# EAGLE design AnalogDaisy (EAGLE 8.5.2)
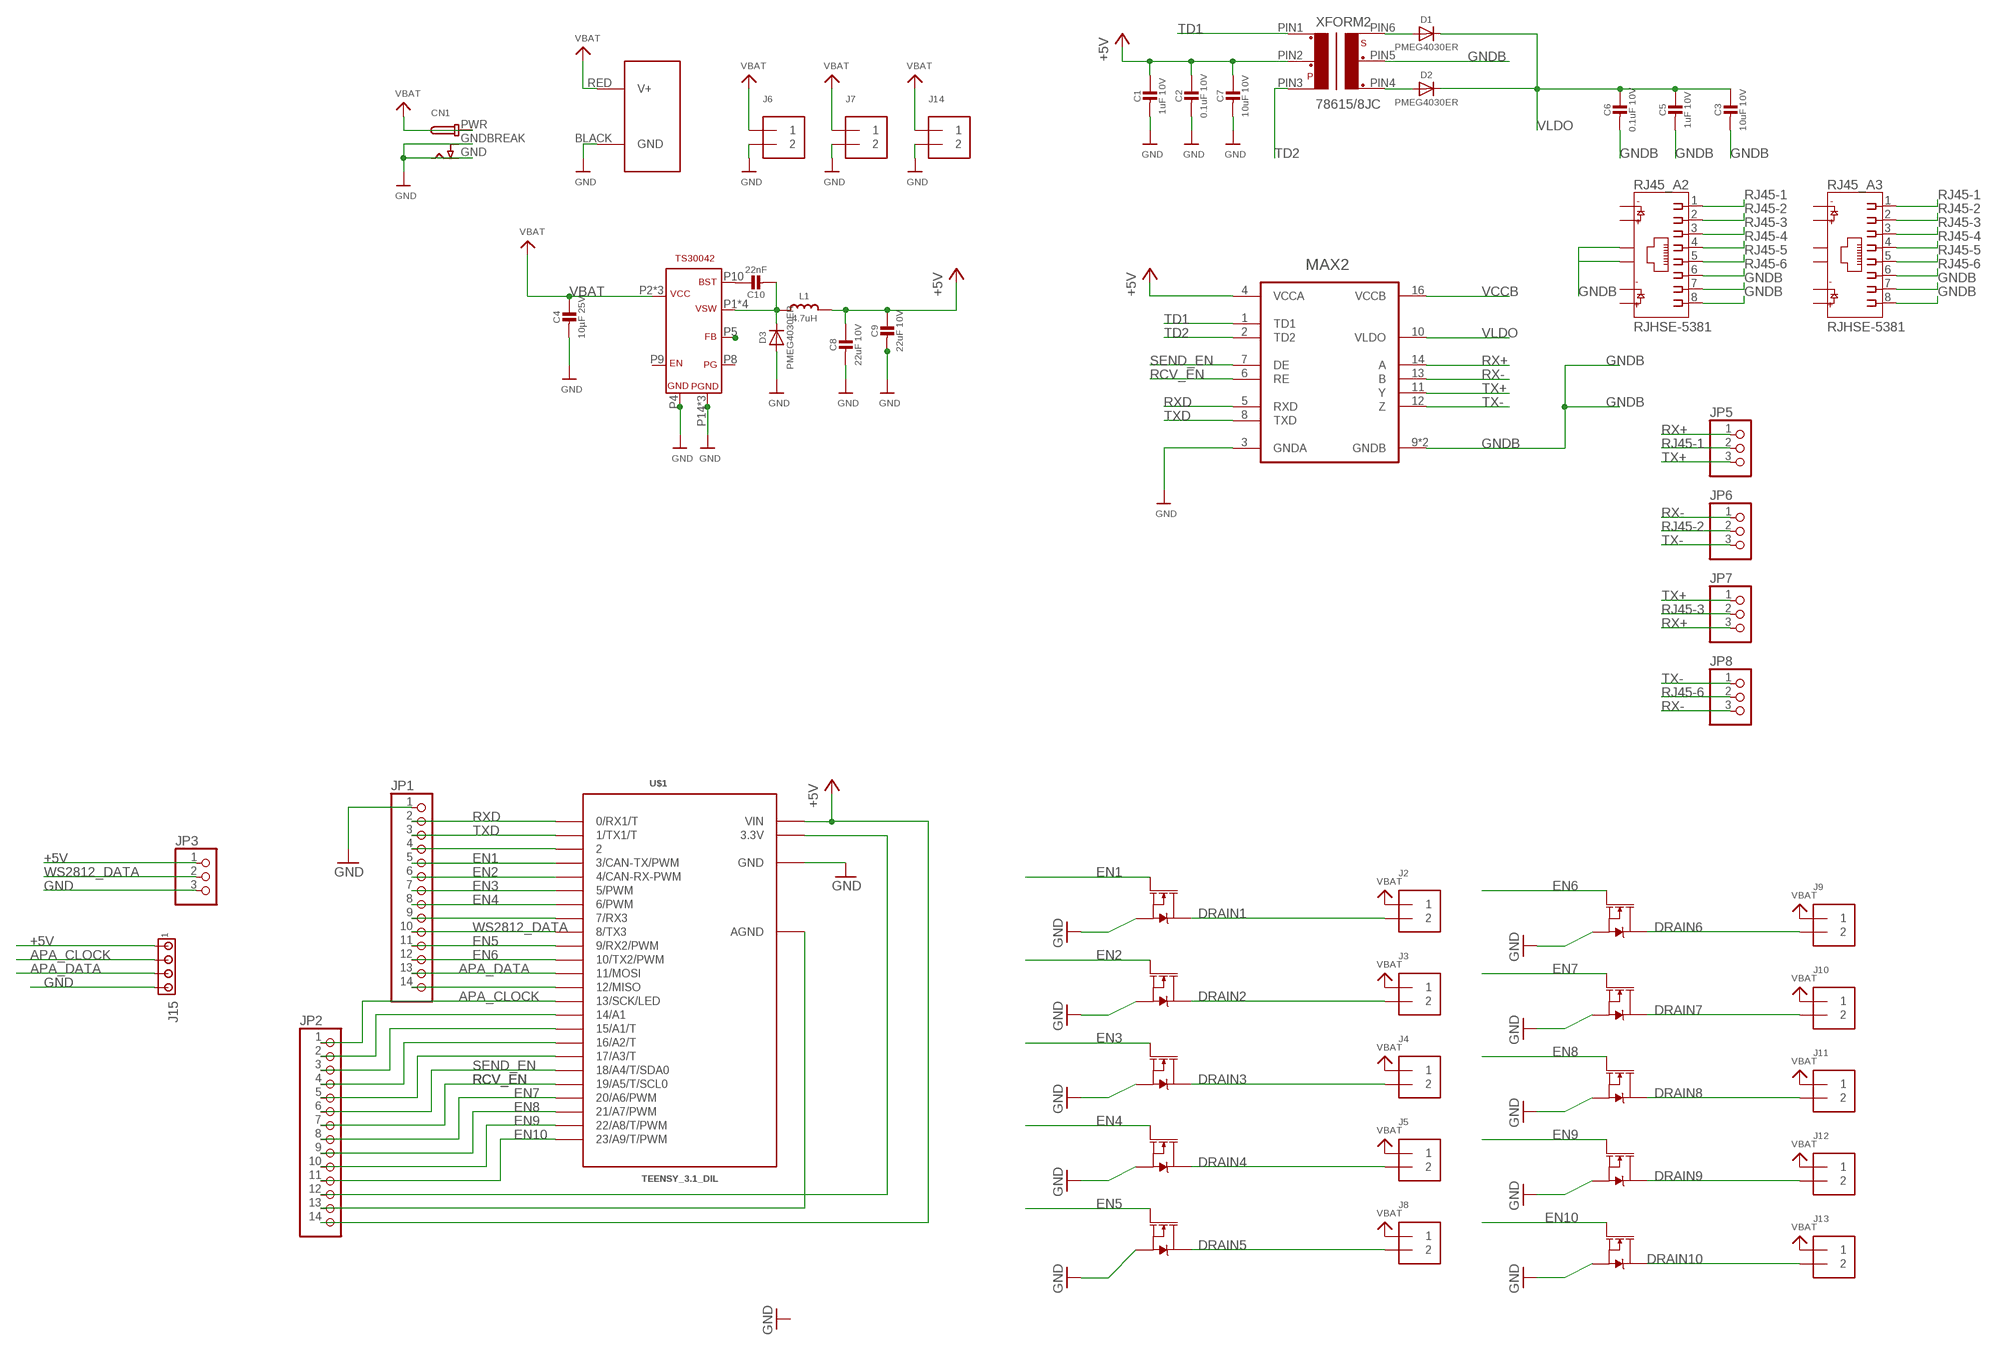
[diagram p0: schematic, sheet 1]

## Parts
C1  1uF 10V  CAP_CERAMIC0603MINI  [0603-MINI]
C2  0.1uF 10V  CAP_CERAMIC0603MINI  [0603-MINI]
C3  10uF 10V  CAP_CERAMIC0603MINI  [0603-MINI]
C4  10µF 25V  CAP_CERAMIC0603MINI  [0603-MINI]
C5  1uF 10V  CAP_CERAMIC0603MINI  [0603-MINI]
C6  0.1uF 10V  CAP_CERAMIC0603MINI  [0603-MINI]
C7  10uF 10V  CAP_CERAMIC0603MINI  [0603-MINI]
C8  22uF 10V  CAP_CERAMIC0603MINI  [0603-MINI]
C9  22uF 10V  CAP_CERAMIC0603MINI  [0603-MINI]
C10  22nF  CAP_CERAMIC0603MINI  [0603-MINI]
CN1  DCBARRELPTH  [DCJACK_2MM_PTH]
D1  PMEG4030ER  DIODESOD-123  [SOD-123]
D2  PMEG4030ER  DIODESOD-123  [SOD-123]
D3  PMEG4030ER  DIODESOD-123  [SOD-123]
J1  POWERPOLE_POWER45A_DRILL  [POWERPOLE_PAIR_45A_HOLE]
J2  TERMBLOCK_1X2  [TERMBLOCK_1X2-3.5MM]
J3  TERMBLOCK_1X2  [TERMBLOCK_1X2-3.5MM]
J4  TERMBLOCK_1X2  [TERMBLOCK_1X2-3.5MM]
J5  TERMBLOCK_1X2  [TERMBLOCK_1X2-3.5MM]
J6  TERMBLOCK_1X2  [TERMBLOCK_1X2-3.5MM]
J7  TERMBLOCK_1X2  [TERMBLOCK_1X2-3.5MM]
J8  TERMBLOCK_1X2  [TERMBLOCK_1X2-3.5MM]
J9  TERMBLOCK_1X2  [TERMBLOCK_1X2-3.5MM]
J10  TERMBLOCK_1X2  [TERMBLOCK_1X2-3.5MM]
J11  TERMBLOCK_1X2  [TERMBLOCK_1X2-3.5MM]
J12  TERMBLOCK_1X2  [TERMBLOCK_1X2-3.5MM]
J13  TERMBLOCK_1X2  [TERMBLOCK_1X2-3.5MM]
J14  TERMBLOCK_1X2  [TERMBLOCK_1X2-3.5MM]
J15  4PIN-JST/TE  [BOARDMOUNT-LED]
JP1  PINHD-1X14  [1X14]
JP2  PINHD-1X14  [1X14]
JP3  PINHD-1X3  [1X03]
JP5  PINHD-1X3  [1X03]
JP6  PINHD-1X3  [1X03]
JP7  PINHD-1X3  [1X03]
JP8  PINHD-1X3  [1X03]
L1  4.7uH  INDUCTORTDK_VLC5045  [INDUCTOR_5X5MM_TDK_VLC5045]
MAX2  MAX14853GWE+  [SOIC127P1034X267-16N]
Q1  35A/25V/8.5mΩ  MOSFET-NCH-FDD8780  [DPAK]
Q2  35A/25V/8.5mΩ  MOSFET-NCH-FDD8780  [DPAK]
Q3  35A/25V/8.5mΩ  MOSFET-NCH-FDD8780  [DPAK]
Q4  35A/25V/8.5mΩ  MOSFET-NCH-FDD8780  [DPAK]
Q5  35A/25V/8.5mΩ  MOSFET-NCH-FDD8780  [DPAK]
Q6  35A/25V/8.5mΩ  MOSFET-NCH-FDD8780  [DPAK]
Q7  35A/25V/8.5mΩ  MOSFET-NCH-FDD8780  [DPAK]
Q8  35A/25V/8.5mΩ  MOSFET-NCH-FDD8780  [DPAK]
Q9  35A/25V/8.5mΩ  MOSFET-NCH-FDD8780  [DPAK]
Q10  35A/25V/8.5mΩ  MOSFET-NCH-FDD8780  [DPAK]
RJ45_A2  RJHSE-5381  [AMPHENOL_RJHSE-5381]
RJ45_A3  RJHSE-5381  [AMPHENOL_RJHSE-5381]
U$1  TEENSY_3.1_DIL  [TEENSY3-DIL]
U$2  BUCK_CONVERTER  [QFN-16]
XFORM2  78615/8JC  [0.1_SMD]

## Nets
+3V1: U$2.P5(FB)
+5V: C1.1 C2.1 C7.1 C8.1 C9.1 J15.1 JP2.14 JP3.1 L1.P$2 MAX2.4(VCCA) U$1.VIN XFORM2.PIN2
APA_CLOCK: J15.2 JP2.1 U$1.13(13/SCK/LED)
APA_DATA: J15.3 JP1.13 U$1.11(11/MOSI)
DRAIN1: J2.2 Q1.4(D)
DRAIN2: J3.2 Q3.4(D)
DRAIN3: J4.2 Q5.4(D)
DRAIN4: J5.2 Q6.4(D)
DRAIN5: J8.2 Q2.4(D)
DRAIN6: J9.2 Q4.4(D)
DRAIN7: J10.2 Q7.4(D)
DRAIN8: J11.2 Q8.4(D)
DRAIN9: J12.2 Q9.4(D)
DRAIN10: J13.2 Q10.4(D)
EN1: JP1.5 Q1.1(G) U$1.3(3/CAN-TX/PWM)
EN2: JP1.6 Q3.1(G) U$1.4(4/CAN-RX-PWM)
EN3: JP1.7 Q5.1(G) U$1.5(5/PWM)
EN4: JP1.8 Q6.1(G) U$1.6(6/PWM)
EN5: JP1.11 Q2.1(G) U$1.9(9/RX2/PWM)
EN6: JP1.12 Q4.1(G) U$1.10(10/TX2/PWM)
EN7: JP2.8 Q7.1(G) U$1.20/A6(20/A6/PWM)
EN8: JP2.9 Q8.1(G) U$1.21/A7(21/A7/PWM)
EN9: JP2.10 Q9.1(G) U$1.22/A8(22/A8/T/PWM)
EN10: JP2.11 Q10.1(G) U$1.23/A9(23/A9/T/PWM)
GND: C1.2 C2.2 C4.2 C7.2 C8.2 C9.2 CN1.GND CN1.GNDBREAK D3.A J1.BLACK(GND) J6.2 J7.2 J14.2 J15.4 JP1.1 JP3.3 MAX2.3(GNDA) Q1.3(S) Q2.3(S) Q3.3(S) Q4.3(S) Q5.3(S) Q6.3(S) Q7.3(S) Q8.3(S) Q9.3(S) Q10.3(S) U$1.GND U$2.P4(GND) U$2.P14(PGND) U$2.P15(PGND) U$2.PAD(PGND)
GNDB: C3.2 C5.2 C6.2 MAX2.9(GNDB) MAX2.15(GNDB) RJ45_A2.7 RJ45_A2.8 RJ45_A2.S1 RJ45_A2.S2 RJ45_A3.7 RJ45_A3.8 XFORM2.PIN5
N$1: C10.1 U$2.P10(BST)
N$2: D1.A XFORM2.PIN6
N$3: JP2.12 U$1.3.3V
N$4: C10.2 D3.C L1.P$1 U$2.P1(VSW) U$2.P12(VSW) U$2.P13(VSW) U$2.P16(VSW)
N$5: D2.A XFORM2.PIN4
N$6: JP1.4 U$1.2
N$7: JP1.9 U$1.7(7/RX3)
N$10: JP1.14 U$1.12(12/MISO)
N$12: JP2.2 U$1.14/A0(14/A1)
N$13: JP2.3 U$1.15/A1(15/A1/T)
N$14: JP2.4 U$1.16/A2(16/A2/T)
N$15: JP2.5 U$1.17/A3(17/A3/T)
N$18: JP2.13 U$1.AGND
RCV_EN: JP2.7 MAX2.6(RE) U$1.19/A5(19/A5/T/SCL0)
RJ45-1: JP5.2 RJ45_A2.1 RJ45_A3.1
RJ45-2: JP6.2 RJ45_A2.2 RJ45_A3.2
RJ45-3: JP7.2 RJ45_A2.3 RJ45_A3.3
RJ45-4: RJ45_A2.4 RJ45_A3.4
RJ45-5: RJ45_A2.5 RJ45_A3.5
RJ45-6: JP8.2 RJ45_A2.6 RJ45_A3.6
RX+: JP5.1 JP7.3 MAX2.14(A)
RX-: JP6.1 JP8.3 MAX2.13(B)
RXD: JP1.2 MAX2.5(RXD) U$1.0(0/RX1/T)
SEND_EN: JP2.6 MAX2.7(DE) U$1.18/A4(18/A4/T/SDA0)
TD1: MAX2.1(TD1) XFORM2.PIN1
TD2: MAX2.2(TD2) XFORM2.PIN3
TX+: JP5.3 JP7.1 MAX2.11(Y)
TX-: JP6.3 JP8.1 MAX2.12(Z)
TXD: JP1.3 MAX2.8(TXD) U$1.1(1/TX1/T)
VBAT: C4.1 CN1.PWR J1.RED(V+) J2.1 J3.1 J4.1 J5.1 J8.1 J9.1 J10.1 J11.1 J12.1 J13.1 U$2.P2(VCC) U$2.P3(VCC) U$2.P11(VCC)
VCCB: MAX2.16(VCCB)
VLDO: C3.1 C5.1 C6.1 D1.C D2.C MAX2.10(VLDO)
WS2812_DATA: JP1.10 JP3.2 U$1.8(8/TX3)
Unconnected: J6.1 J7.1 J14.1 RJ45_A2.9 RJ45_A2.10 RJ45_A2.11 RJ45_A2.12 RJ45_A3.9 RJ45_A3.10 RJ45_A3.11 RJ45_A3.12 RJ45_A3.S1 RJ45_A3.S2 U$2.P8(PG) U$2.P9(EN)

## Library data of the parts
C1-C10 = microbuilder:CAP_CERAMIC: Ceramic Capacitors For new designs, use the packages preceded by an '_' character since they are more reliable: The following footprints should be used on most boards: _0402 - Standard footprint for regular board layouts _0603 - Standard footprint for regular board layouts _0805 - Standard footprint for regular board layouts _1206 - Standard footprint for regular board layouts For extremely tight-pitch boards where space is at a premium, the following 'micro-pitch' footprints can be used (smaller pads, no silkscreen outline, etc.): _0402MP - Micro-pitch footprint for very dense/compact boards _0603MP - Micro-pitch footprint for very dense/compact boards _0805MP - Micro-pitch footprint for very dense/compact boards _1206MP - Micro-pitch footprint for very dense/compact boards
CN1 = microbuilder:DCBARREL: DC Barrel Jack DCJACK_1.3MM_PTH - Through Hole 1.3mm Jack (4UConnector: 05536) DCJACK_2MM_PTH - Through Hole 2.0/2.1 Jack (4UConnector: 05537) DCJACK_2MM_SMT - SMT 2.0/2.1mm Jack(4UConnector: 03267)
D1-D3 = microbuilder:DIODE: Diode SMA Model Volts Amps Type Vf Ir Digikey # Notes SSA34-E3 40V 3A Schottky 480mV @ 3A 200uA @ 40V SSA34-E3/61TGITR-ND CDBA120-G 20V 1A Schottky 500mV @ 1A 500uA @ 20V 641-1014-6-ND REEL MBRA210 10V 2A Schottky 350mV @ 2A 700uA @ 10V MBRA210LT3 SOD-123 Model Volts Amps Type Vf Ir Order # Notes BAT54T1G 30V 200mA Schottky 800mV @ 200mA 2uA @ 25V BAT54T1GOSTR-ND B0530W 30V 500mA Schottky 430mV @ 500mA 130uA @ 30V B0530W-FDICT-ND REEL MBR120 20V 1A Schottky 340mV @ 1A MBR120VLSFT1GOSCT-ND SOD-323 Model Volts Amps Type Vf Ir Order # Notes PMEG2005EJ 20V 500mA Schottky 355mV @ 500mA 568-4110-1-ND ZLLS410 10V 570mA Schottky 380mV @ 570mA ZLLS410CT-ND 1N4148WS 75V 150mA Silicon/Simple 1V 1N4148WSFSCT-ND REEL SOD-523 Model Volts Amps Type Vf Ir Order # Notes BAT54XV2 30V 200mA Schottky 0.8V @ 100mA BAT54XV2CT-ND TB751S 30V 30mA Schottky RB751S-40TE61CT-ND SOT23-R/W (R = Solder Paste/Reflow Ovens, W = Hand-Soldering) Model Volts Amps Type Vf Ir Order # Notes BAT54FILM 40V 300mA Schottky 497-7162-1-ND POWERDI-5 Model Volts Amps Type Vf Ir Order # Notes PDS560 60V 5A Schottky 670mV @ 5A 150uA @ 60V PDS560DICT-ND
J1 = powerpoles:POWERPOLE_POWER: Anderson Powerpole Power Connector using ameteur radio standard layout
J2-J14 = microbuilder:TERMBLOCK_1X2: 3.5mm Terminal block http://www.ladyada.net/library/pcb/eaglelibrary.html
J15 = My Connectors:4PIN-JST/TE: AMP connector
JP1 JP2 = adafruit:PINHD-1X14: PIN HEADER
JP3 JP5-JP8 = adafruit:PINHD-1X3: PIN HEADER
L1 = microbuilder:INDUCTOR: Inductors 0603: 10nH Ceramic Inductor - microwire antenna/RF (Digikey: 712-1434-2-ND) 0805: 560nH Ceramic Inductor - RF (Digikey: 553-1047-1-ND) 270nH Ceramic Inductor - Q = 40@250MHz, +-5%, 1 Ohm DC Resistance (Digikey: 535-10506-2-ND) 1007 (2518 Metric) SMT: 10µH 10% 250mOhm 820mA 1007 Inductor (Digikey: 587-2189-1-ND) 22µH 10% 500mOhm 580mA 1007 Inductor (Digikey: 587-2190-1-ND) 47µH 10% 950mOhm 420mA 1007 Inductor (Digikey: 587-2191-1-ND) 47µH 5% 100mOhm 1A 1008 Inductor (Digikey: 732-1816-1-ND) 5.0x5.0mm (Taiyo Yuden NR5040 Series) 6.8µH 20% 2.3A 64mOhm Inductor (Digikey: 587-2374-2-ND) 5.0x5.0mm (TDK VLC5045 Series) 4.7µH 20% 3.3A 34mOhm Inductor (Digikey: 445-6526-1-ND) 6.8µH 20% 2.7A 46mOhm Inductor (Digikey: 445-6527-1-ND) 6.0x6.0mm (TDK VLC6045 Series) 4.7µH 20% 3.8A 27mOhm Inductor (Digikey: 445-6538-2-ND) 6.8µH 20% 3A 41mOhm Inductor (Digikey: 445-6540-1-ND) 6.2µH 30% 2.2A 45mOhm Inductor (Digikey: SRR5028-6R2YCT-ND) - Not TDK VLC6045 but footprint should match 6.0x6.0mm (TDK SLF6045 Series) 6.8uH 30% 2A 33mOhm Inductor (Digikey: 445-4572-1-ND, Mouser: 810-SLF645T6R8N2R0PF) 6.0x6.0mm (Sumida CDRH5D28 Series) 6.2uH 30% 1.8A 45mOhm Inductor (Digikey: 308-1542-1-ND) Taiyo Yuden NR3015T2R2M - 2.2uH 20% 1.5A (Digikey: 587-1648-2-ND, Mouser: 963-NR3015T2R2M) - Used with TI TPS62172 CoilCraft RFID Transponder Coil - MA5532-AE (For use with AS3935 Lightning Sensor) Taiyo Yuden NRH2412T2R2MNGH - 2.2uH 20% 1AA (Digikey: 587-3443-1-ND) - Used with TI LM3671 Vishay IHLP 1.0uH Molded Inductor - 24mOhm DCR, 5A, +/-20%, -55°C-125°C (Digikey: 541-1319-1-ND)
MAX2 = Maxim_By_element14_Batch_1:MAX14853GWE+: Isolated RS-485 Tranceiver
Q1-Q10 = SparkFun-DiscreteSemi:MOSFET-NCH: N-channel MOSFETs Voltage controlled devices that allow control of high current outputs. SparkFun Products: SparkFun OpenScale <https://www.sparkfun.com/products/13261> SparkFun Digital Sandbox <https://www.sparkfun.com/products/12651> SparkFun Monster Moto Shield <https://www.sparkfun.com/products/10182> SparkFun MOSFET Power Controller <https://www.sparkfun.com/products/11214>; PROD_ID: TRANS-09984
RJ45_A2 RJ45_A3 = RJHSE-5381:RJHSE-5381: connector, mod jack, rt angle pcb, shielded, led1-g, led2-y, single port, rj-45 8 cont; AVAILABILITY: Good; DESCRIPTION: CONN MOD JACK 8P8C R/A SHIELDED; MF: Amphenol; MP: RJHSE-5381; PACKAGE: None; PRICE: 1.11 USD
U$1 = Teensy_3_and_LC_Series_Boards_v1.0:TEENSY_3.1_DIL: Teensy 3.1 or 3.2 in a DIL Layout.
U$2 = Heep:BUCK_CONVERTER
XFORM2 = trafo-murata:78615/8JC

## Board
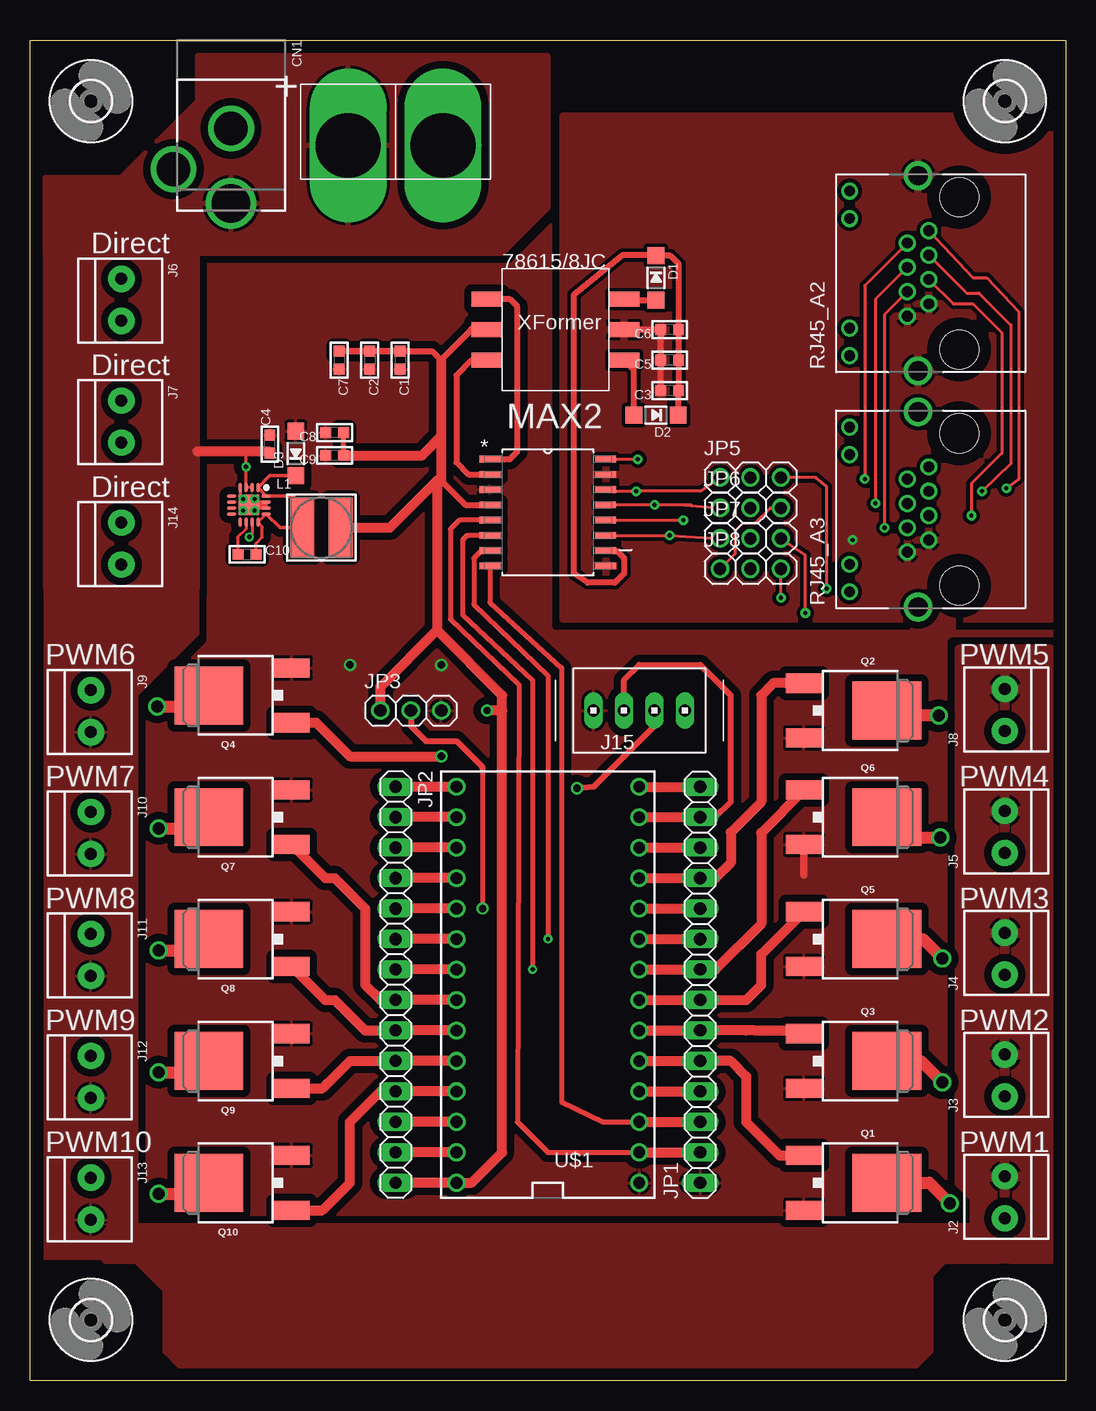
[diagram p1: board, top side]
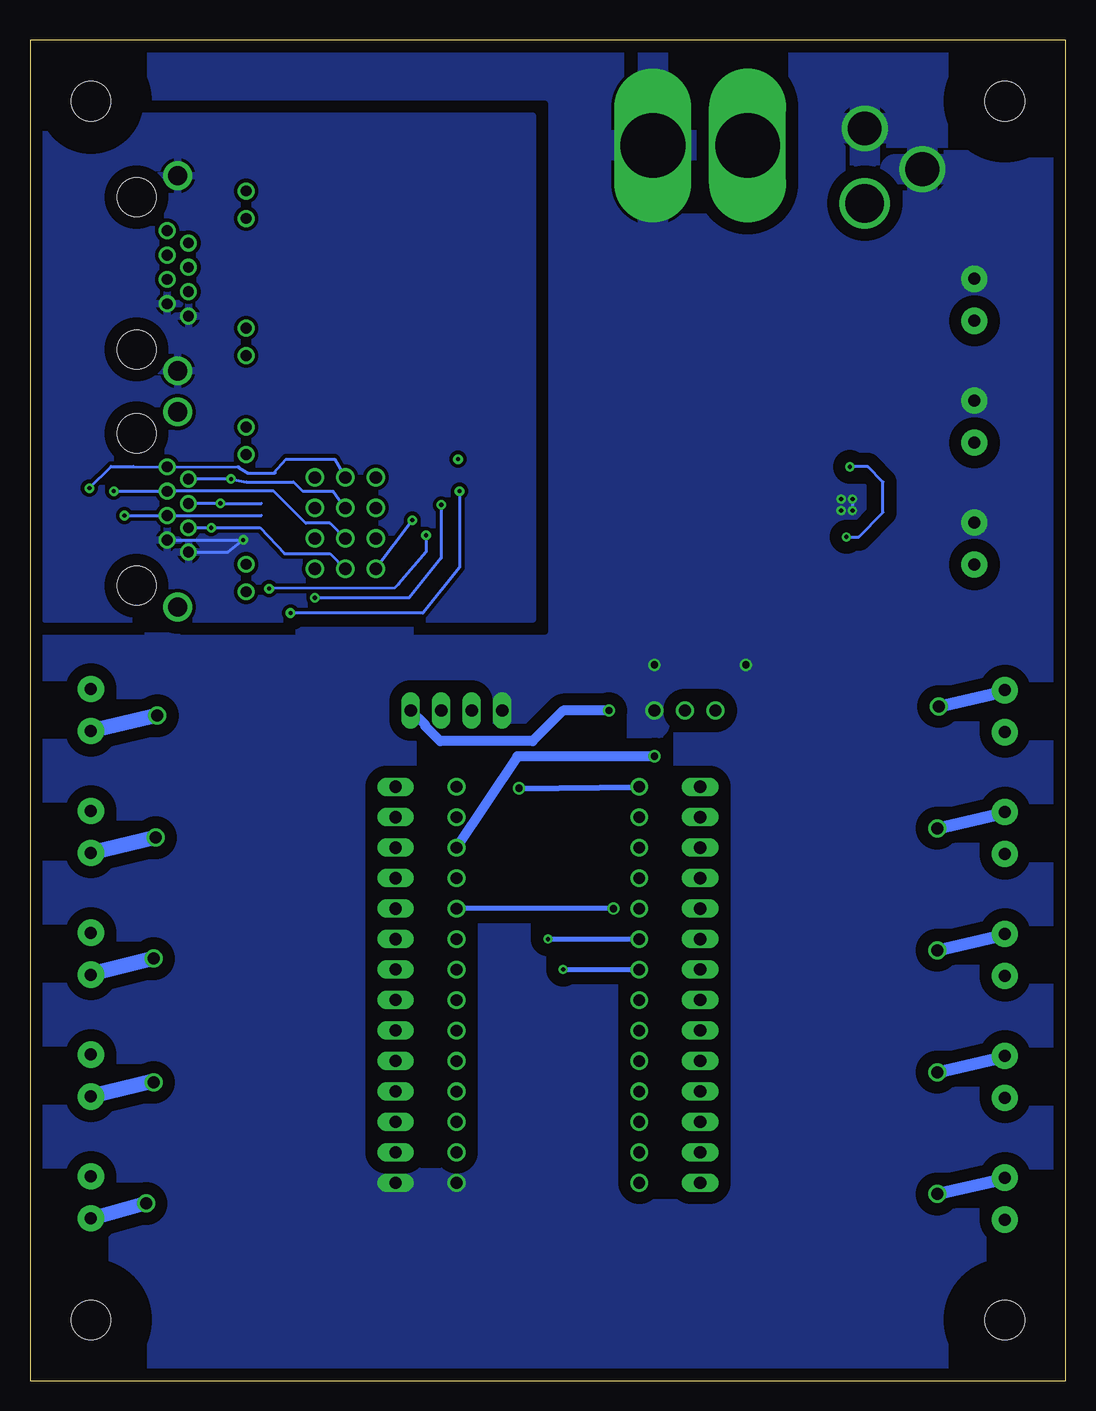
[diagram p2: board, bottom side, seen from below]

Size 86.36 x 111.76 mm. Coordinates in mm from the lower left corner, seen from the top.
Outline: 86.36,111.76 86.36,0 0,0 0,111.76 86.36,111.76
Copper layers (1*16): Top 0.035mm / dielectric 1.5mm / Bottom 0.035mm
Design rules "default": minimum track width 6mil, minimum drill 0.35mm, track to track 6mil, track to pad 6mil, pad to pad 6mil, via to via 6mil, smd to smd 6mil, copper to edge 40mil, drill to drill 6mil, minimum pad ring 10mil, minimum via ring 8mil, stop-mask expansion 4mil, vias tented up to drill 0mil, thermal gap 10mil

### Footprints (pad centres in the part's own frame; a part is rotated, then mirrored left to right if it is on the bottom)
0603-MINI = smd 0.9 x 0.9: 1 -0.75,0; 2 0.75,0
DCJACK_2MM_PTH = drill 2.8: GND 0,7.35; GNDBREAK 4.8,10.75 | drill 3.2: PWR 0,13.6
SOD-123 = smd 1.4 x 1.4: A 1.85,0; C -1.85,0
POWERPOLE_PAIR_45A_HOLE = drill 5.4 long: BLACK 3.95,-1.15; RED -3.95,-1.15
TERMBLOCK_1X2-3.5MM = drill 1 pad 2.184: 1 1.8,0; 2 -1.7,0
BOARDMOUNT-LED = drill 1.016 long: 1 3.81,0; 2 1.27,0; 3 -1.27,0; 4 -3.81,0
1X14 = drill 1.016 long: 1 -16.51,0; 2 -13.97,0; 3 -11.43,0; 4 -8.89,0; 5 -6.35,0; 6 -3.81,0; 7 -1.27,0; 8 1.27,0; 9 3.81,0; 10 6.35,0; 11 8.89,0; 12 11.43,0; 13 13.97,0; 14 16.51,0
1X03 = drill 1.016: 1 -2.54,0; 2 0,0; 3 2.54,0
INDUCTOR_5X5MM_TDK_VLC5045 = smd 2 x 5: P$1 -1.6,0; P$2 1.6,0
SOIC127P1034X267-16N = smd 1.727 x 0.559: 1 -4.826,4.445; 2 -4.826,3.175; 3 -4.826,1.905; 4 -4.826,0.635; 5 -4.826,-0.635; 6 -4.826,-1.905; 7 -4.826,-3.175; 8 -4.826,-4.445; 9 4.826,-4.445; 10 4.826,-3.175; 11 4.826,-1.905; 12 4.826,-0.635; 13 4.826,0.635; 14 4.826,1.905; 15 4.826,3.175; 16 4.826,4.445
DPAK = smd 1.6 x 3: 1 -2.28,-5.31; 3 2.28,-5.31 | smd 4.826 x 5.715: 4 0,1.588
AMPHENOL_RJHSE-5381 = drill 0.9: 1 3.55,2.54; 2 2.53,4.32; 3 1.52,2.54; 4 0.5,4.32; 5 -0.51,2.54; 6 -1.53,4.32; 7 -2.54,2.54; 8 -3.56,4.32; 9 6.86,9.14; 10 4.57,9.14; 11 -4.57,9.14; 12 -6.86,9.14 | drill 1.6: S1 8.13,3.43; S2 -8.13,3.43 | hole 3.25: 6.35,0; -6.35,0
TEENSY3-DIL = drill 0.965: 0 -7.62,13.97; 1 -7.62,11.43; 2 -7.62,8.89; 3 -7.62,6.35; 3.3V 7.62,11.43; 4 -7.62,3.81; 5 -7.62,1.27; 6 -7.62,-1.27; 7 -7.62,-3.81; 8 -7.62,-6.35; 9 -7.62,-8.89; 10 -7.62,-11.43; 11 -7.62,-13.97; 12 -7.62,-16.51; 13 7.62,-16.51; 14/A0 7.62,-13.97; 15/A1 7.62,-11.43; 16/A2 7.62,-8.89; 17/A3 7.62,-6.35; 18/A4 7.62,-3.81; 19/A5 7.62,-1.27; 20/A6 7.62,1.27; 21/A7 7.62,3.81; 22/A8 7.62,6.35; 23/A9 7.62,8.89; AGND 7.62,13.97; GND -7.62,16.51; VIN 7.62,16.51
QFN-16 = smd 0.8 x 0.3: P1 -1.45,0.75; P2 -1.45,0.25; P3 -1.45,-0.25; P4 -1.45,-0.75; P9 1.45,-0.75; P10 1.45,-0.25; P11 1.45,0.25; P12 1.45,0.75 | smd 0.3 x 0.8: P5 -0.75,-1.45; P6 -0.25,-1.45; P7 0.25,-1.45; P8 0.75,-1.45; P13 0.75,1.45; P14 0.25,1.45; P15 -0.25,1.45; P16 -0.75,1.45 | smd 1.7 x 1.7: PAD 0,0
3,3 = hole 3.3: 0,0
0.1_SMD = smd 2.54 x 1.27: PIN1 -11.43,1.27; PIN2 -11.43,-1.27; PIN3 -11.43,-3.81; PIN4 0,-3.81; PIN5 0,-1.27; PIN6 0,1.27

### Placement (x,y rotation side)
C1  30.86,85.09 270 top
C2  28.32,85.09 270 top
C3  53.34,82.55 180 top
C4  20,78.1 90 top
C5  53.34,85.09 180 top
C6  53.34,87.63 180 top
C7  25.78,85.09 270 top
C8  25.4,79.06 180 top
C9  25.4,77.15 180 top
C10  18.1,68.9 0 top
CN1  16.76,111.76 180 top
D1  52.2,91.95 270 top
D2  52.2,80.52 180 top
D3  22.16,77.32 90 top
J1  30.48,104.14 0 top
J2  81.28,15.24 90 top
J3  81.28,25.4 90 top
J4  81.28,35.56 90 top
J5  81.28,45.72 90 top
J6  7.62,90.17 270 top
J7  7.62,80.01 270 top
J8  81.28,55.88 90 top
J9  5.08,55.88 270 top
J10  5.08,45.72 270 top
J11  5.08,35.56 270 top
J12  5.08,25.4 270 top
J13  5.08,15.24 270 top
J14  7.62,69.85 270 top
J15  50.8,55.88 0 top
JP1  55.88,33.02 90 top
JP2  30.48,33.02 270 top
JP3  31.75,55.88 0 top
JP5  60.07,75.31 0 top
JP6  60.07,72.77 0 top
JP7  60.07,70.23 0 top
JP8  60.07,67.69 0 top
L1  24.29,71.12 0 top
MAX2  43.18,72.39 0 top
Q1  69.85,16.51 270 top
Q2  69.85,55.88 270 top
Q3  69.85,26.67 270 top
Q4  16.51,57.15 90 top
Q5  69.85,36.83 270 top
Q6  69.85,46.99 270 top
Q7  16.51,46.99 90 top
Q8  16.51,36.83 90 top
Q9  16.51,26.67 90 top
Q10  16.51,16.51 90 top
RJ45_A2  77.47,92.33 90 top
RJ45_A3  77.47,72.64 90 top
U$1  43.18,33.02 180 top
U$2  18.26,73.03 270 top
U$11  [3,3]  5.08,106.68 0 top
U$15  [3,3]  81.28,106.68 0 top
U$16  [3,3]  5.08,5.08 0 top
U$19  [3,3]  81.28,5.08 0 top
XFORM2  49.53,88.9 0 top

### Tracks (layer width: path | path; a pad name or v marks a point on that pad's centre or on a via)
+5V  (via drill 0.6 pad 0.8)
  Top 0.406: C9.1 C8.1
  Top 0.508: 36.83,87.63 34.29,85.09 33.54,85.84 C7.1 C2.1 C1.1 | 34.29,75.06 36.32,73.03 MAX2.4
  Top 0.61: 36.83,87.63 XFORM2.PIN2
  Top 0.813: L1.P$2 30,71.12 33.94,75.06 | 34.29,78.74 32.7,77.15 C9.1 | 34.29,85.09 34.29,78.74 | 34.29,78.74 34.29,75.06 33.94,75.06 | 33.94,75.06 33.94,62.58 | JP2.14 U$1.VIN 36.83,16.51 39.37,19.05 39.37,55.88 | 39.37,55.88 39.37,57.15 33.94,62.58 | JP3.1 29.21,57.85 33.94,62.58 | 39.37,55.88 v38.1,55.88
  Bottom 0.813: v38.1,55.88 41.91,55.88 44.45,53.34 52.16,53.34 53.39,54.57 53.39,54.66 J15.1
APA_CLOCK  (via drill 0.6 pad 0.8)
  Top 0.508: J15.2 52.07,54.61 46.99,49.53 v45.59,49.4
  Top 0.813: U$1.13 JP2.1
  Bottom 0.508: v45.59,49.4 U$1.13
APA_DATA
  Top 0.508: J15.3 49.53,58.42 50.8,59.69 55.88,59.69 58.42,57.15 58.42,48.26 57.15,46.99 JP1.13
  Top 0.813: U$1.11 JP1.13
DRAIN1  (via drill 1)
  Top 1.016: Q1.4 74.96,16.51 v76.68,14.79
  Bottom 1.27: v76.68,14.79 81.26,13.52 J2.2
DRAIN2  (via drill 1)
  Top 1.016: Q3.4 74.26,26.67 v76.05,24.88
  Bottom 1.27: v76.05,24.88 76.13,24.97 J3.2
DRAIN3  (via drill 1)
  Top 1.016: Q5.4 74.42,36.83 v76.05,35.2
  Bottom 1.016: v76.05,35.2 76.12,35.13
  Bottom 1.27: v76.05,35.2 81.21,33.93 J4.2
DRAIN4  (via drill 1)
  Top 1.016: Q6.4 73.13,45.3 v75.88,45.3
  Bottom 1.016: v75.88,45.3 v75.88,45.29
  Bottom 1.27: v75.88,45.3 J5.2
DRAIN5  (via drill 1)
  Top 1.016: v75.75,55.45 71.86,55.45 Q2.4
  Bottom 0.61: v75.75,55.45 v75.76,55.45
  Bottom 1.27: v75.75,55.45 J8.2
DRAIN6  (via drill 1)
  Top 1.016: v10.6,56.22 13.63,56.22 13.97,55.88 13.97,55.56 Q4.4
  Bottom 1.016: v10.6,56.22 5.17,57.49 J9.2
DRAIN7  (via drill 1)
  Top 1.016: v10.73,46.06 13.99,46.06 Q7.4
  Bottom 1.016: v10.73,46.06 5.17,47.33 J10.2
DRAIN8  (via drill 1)
  Top 1.016: v10.73,35.9 13.99,35.9 Q8.4
  Bottom 1.016: v10.73,35.9 5.17,37.17 J11.2
DRAIN9  (via drill 1)
  Top 0.254: Q9.4 13.32,25.74
  Top 1.016: Q9.4 13.99,25.74 v10.73,25.74
  Bottom 1.016: v10.73,25.74 5.17,27.01 J12.2
DRAIN10  (via drill 1)
  Top 0.254: Q10.4 13.65,15.24 12.7,15.24
  Top 1.016: 12.7,15.24 13.97,15.24 | v10.73,15.58 13.99,15.58 Q10.4
  Bottom 1.016: v10.73,15.58 5.17,16.85 J13.2
EN1
  Top 0.813: U$1.3 JP1.5 58.42,26.67 59.69,25.4 59.69,21.59 62.49,18.79 Q1.1
EN2
  Top 0.813: U$1.4 JP1.6 59.69,29.21 60.47,29.21 64.28,29.21 Q3.1
EN3
  Top 0.813: U$1.5 JP1.7 59.72,31.75 60.96,32.99 60.96,35.56 64.51,39.11 Q5.1
EN4
  Top 0.813: U$1.6 JP1.8 57.15,34.29 60.96,38.1 60.96,45.69 Q6.1
EN5
  Top 0.813: U$1.9 JP1.11 57.15,41.91 58.42,43.18 58.42,45.72 60.96,48.26 60.96,57.15 61.97,58.16 Q2.1
EN6  (via drill 0.6 pad 0.8)
  Top 0.813: U$1.10 JP1.12 | Q4.1 23.87,54.87 26.67,52.07 v34.29,52.07
  Bottom 0.813: v34.29,52.07 45.72,52.07 U$1.10
EN7
  Top 0.813: U$1.20/A6 JP2.8 29.21,31.75 27.94,33.02 27.94,39.37 25.4,41.91 24.62,41.91 Q7.1
EN8
  Top 0.813: U$1.21/A7 JP2.9 27.94,29.21 25.4,31.75 24.62,31.75 Q8.1
EN9
  Top 0.813: U$1.22/A8 JP2.10 26.67,26.67 24.77,24.77 24.39,24.39 Q9.1
EN10
  Top 0.813: U$1.23/A9 JP2.11 29.21,24.13 26.67,21.59 26.67,16.51 24.39,14.23 Q10.1
GND  (via drill 0.35, 0.6 pad 0.8)
  Top 0.254: U$2.P4 17.51,73.78 v17.78,73.5
  Top 0.305: v18.73,72.55 18.96,72.78 U$2.P14 U$2.P15 | U$2.PAD 19.46,73.03 U$2.P15 | U$2.P15 18.96,73.28 v18.73,73.5
  Top 0.61: 64.54,42.17 Q6.3
  Bottom 0.254: 17.78,73.66 v17.78,72.55 v17.78,73.5
  other vias: 26.67,59.69 34.29,59.69
  pour Top (isolate 0.61, rank 2): -3.81,116.84 88.9,116.84 88.9,-5.08 -3.81,-3.81
  pour Bottom (isolate 1.016, rank 2): -8.89,121.92 91.44,121.92 92.71,-8.89 -7.62,-8.89 -10.16,2.54
GNDB  (via drill 0.35 pad 0.8)
  Top 0.508: C3.2 C6.2 XFORM2.PIN5
  Bottom 0.254: RJ45_A3.8 69.85,69.09 | 69.85,69.09 | 69.85,69.09 v68.58,70.1 RJ45_A3.7
  pour Top (isolate 0.305): 44.45,105.41 44.45,63.5 85.09,63.5 85.09,105.41
  pour Bottom (isolate 0.305): 44.45,105.41 44.45,63.5 85.09,63.5 85.09,105.41
N$1
  Top 0.254: U$2.P10 18.01,71.03 17.3,70.33 17.3,68.94 C10.1
N$2
  Top 0.508: XFORM2.PIN6 49.6,90.1 D1.A
N$3
  Top 0.813: U$1.3.3V JP2.12
N$4
  Top 0.254: C10.2 18.85,69.81 19.37,70.33 19.37,71.21 U$2.P12 U$2.P13
  Top 0.305: D3.C 20,75.47 U$2.P1 U$2.P16 21.95,73.78 22.7,73.03 22.69,73.01 L1.P$1 20.86,71.12 U$2.P13
N$5
  Top 0.508: D2.A 50.35,84.27 XFORM2.PIN4
N$6
  Top 0.813: U$1.2 JP1.4
N$7
  Top 0.813: U$1.7 JP1.9
N$10
  Top 0.813: U$1.12 JP1.14
N$12
  Top 0.813: U$1.14/A0 JP2.2
N$13
  Top 0.813: U$1.15/A1 JP2.3
N$14
  Top 0.813: U$1.16/A2 JP2.4
N$15
  Top 0.813: U$1.17/A3 JP2.5
N$18
  Top 0.813: U$1.AGND JP2.13
RCV_EN  (via drill 0.35)
  Top 0.406: MAX2.6 36.45,70.48 36.07,70.1 36.07,63.88 41.91,58.42 v41.91,34.29
  Top 0.813: U$1.19/A5 JP2.7
  Bottom 0.406: v41.91,34.29 U$1.19/A5
RJ45-1  (via drill 0.35 pad 0.8)
  Top 0.254: RJ45_A2.1 78.61,91.95 79.76,91.95 82.42,89.15 82.42,75.18 v81.41,74.42
  Bottom 0.254: v81.41,74.42 79.6,76.23 77.72,76.23 RJ45_A3.1 69.09,76.2 | 69.09,76.2 68.96,76.2 | 69.09,76.2 68.2,75.69 66.04,75.69 | 66.04,75.69 65.91,75.69 | 66.04,75.69 65.02,76.84 60.96,76.84 JP5.2
RJ45-2  (via drill 0.35 pad 0.8)
  Top 0.254: RJ45_A2.2 69.6,91.31 v69.6,75.18
  Bottom 0.254: RJ45_A3.2 73.14,75.18 v69.6,75.18 68.33,74.93 64.39,74.93 63.63,74.17 61.09,74.17 JP6.2
RJ45-3  (via drill 0.35 pad 0.8)
  Top 0.254: RJ45_A2.3 78.1,90.68 79.12,90.68 81.79,88.01 81.79,76.45 v79.38,74.17
  Bottom 0.254: v79.38,74.17 RJ45_A3.3 66.04,74.17 63.37,71.5 61.34,71.5 JP7.2
RJ45-4  (via drill 0.35 pad 0.8)
  Top 0.254: RJ45_A2.4 70.48,90.16 v70.48,73.15
  Bottom 0.254: RJ45_A3.4 70.49,73.14 v70.48,73.15 67.06,73.15
RJ45-5  (via drill 0.35 pad 0.8)
  Top 0.254: RJ45_A2.5 76.96,89.79 78.61,89.79 81.03,87.38 81.03,77.34 78.49,74.8 v78.49,72.14
  Bottom 0.254: v78.49,72.14 v78.48,72.13 RJ45_A3.5 67.06,72.14
RJ45-6  (via drill 0.35 pad 0.8)
  Top 0.254: RJ45_A2.6 71.25,88.9 v71.25,71.12
  Bottom 0.254: RJ45_A3.6 v71.25,71.11 v71.25,71.12 67.18,71.12 65.15,68.96 61.34,68.96 JP8.2
RX+  (via drill 0.35 pad 0.8)
  Top 0.254: MAX2.14 48.13,74.17 v50.55,74.17 55.88,74.17 JP5.1 | v64.64,64.01 64.64,68.83 JP7.3
  Bottom 0.254: v50.55,74.17 50.55,67.82 53.59,64.01 v64.64,64.01
RX-  (via drill 0.35 pad 0.8)
  Top 0.254: 55.12,73.03 54.61,73.03 | 54.61,73.03 v52.07,73.03 MAX2.13 | 54.61,73.03 JP6.1 | v62.61,65.28 JP8.3
  Bottom 0.254: v52.07,73.03 52.07,68.58 54.74,65.28 v62.61,65.28
RXD
  Top 0.406: MAX2.5 35.81,71.75 35.05,70.99 35.05,63.5 40.77,58.04 40.64,21.59 43.18,19.05 U$1.0
  Top 0.813: U$1.0 JP1.2
SEND_EN  (via drill 0.35)
  Top 0.406: MAX2.7 37.64,69.22 37.01,68.58 37.01,64.72 43.18,58.8 v43.18,36.83
  Top 0.813: U$1.18/A4 JP2.6
  Bottom 0.406: v43.18,36.83 U$1.18/A4
TD1
  Top 0.508: MAX2.1 40.01,76.84 40.64,77.47 40.64,89.53 40.01,90.17 XFORM2.PIN1
TD2
  Top 0.508: XFORM2.PIN3 36.83,85.09 35.56,83.82 35.56,76.58 36.58,75.56 MAX2.2
TX+  (via drill 0.35 pad 0.8)
  Top 0.254: MAX2.11 v53.34,70.48 | v53.34,70.48 53.72,70.48 | v53.34,70.48 JP7.1 | v66.42,66.04 66.42,74.55 65.53,75.31 JP5.3
  Bottom 0.254: v53.34,70.48 53.34,69.09 55.63,66.42 55.94,66.1 v66.42,66.04
TX-  (via drill 0.35 pad 0.8)
  Top 0.254: MAX2.12 v54.48,71.75 | JP8.1 58.8,68.96 58.8,70.87 59.44,71.5 60.45,71.5 61.72,72.77 JP6.3
  Bottom 0.254: v54.48,71.75 JP8.1
TXD
  Top 0.406: MAX2.8 38.35,64.9 44.32,59.44 44.32,23.24 47.75,21.59 U$1.1
  Top 0.813: U$1.1 JP1.3
VBAT  (via drill 0.35)
  Top 0.254: U$2.P2 U$2.P3 v18.01,76.2 18.01,77.24 17.78,77.47 | U$2.P11 18.51,70.58 v18.29,70.36
  Top 0.813: C4.1 19.89,77.47 17.78,77.47 13.97,77.47
  Bottom 0.254: v18.29,70.36 17.27,70.36 15.24,72.39 15.24,74.93 16.51,76.2 v18.01,76.2
  pour Top (isolate 0.61): 13.97,66.04 13.97,62.23 8.89,57.15 8.89,10.16 1.27,10.16 1.27,66.04
  pour Top (isolate 0.61): 6.35,12.7 6.35,10.16 8.89,10.16 11.43,7.62 11.43,2.54 12.7,1.27 73.66,1.27 74.93,2.54 74.93,8.89 76.2,10.16 85.09,10.16 85.09,60.96 77.47,60.96 77.47,16.51 78.74,15.24 78.74,12.7
  pour Top (isolate 0.61): 43.18,110.49 43.18,97.79 39.37,93.98 1.27,93.98 1.27,100.33 7.62,100.33 13.97,106.68 13.97,110.49
  pour Top (isolate 0.61): 1.27,96.52 1.27,66.04 13.97,66.04 13.97,96.52
VCCB  (via drill 0.35 pad 0.8)
  Top 0.254: MAX2.16 v50.67,76.84
VLDO
  Top 0.508: MAX2.10 48.89,69.22 49.53,68.58 49.53,67.31 48.77,66.55 46.48,66.55 45.34,67.31 45.34,90.55 49.4,93.85 52.14,93.85 D1.C 53.39,93.8 54.09,93.1 C6.1 C5.1 C3.1 54.1,82.54 54.05,82.48 D2.C
WS2812_DATA  (via drill 0.6 pad 0.8)
  Top 0.406: 37.72,51.05 v37.72,39.37
  Top 0.508: JP3.2 31.75,54.61 33.02,53.34 35.56,53.34 37.72,51.18 37.72,51.05
  Top 0.813: U$1.8 JP1.10
  Bottom 0.406: v37.72,39.37 U$1.8

### Text on the board
tPlace: PWM6 | PWM5 | PWM7 | PWM4 | PWM8 | PWM3 | PWM9 | PWM2 | PWM10 | PWM1
tNames: Direct | Direct | Direct
tSilk: Direct | Direct | Direct